# Altium project FT2232_JTAG.PrjPcb
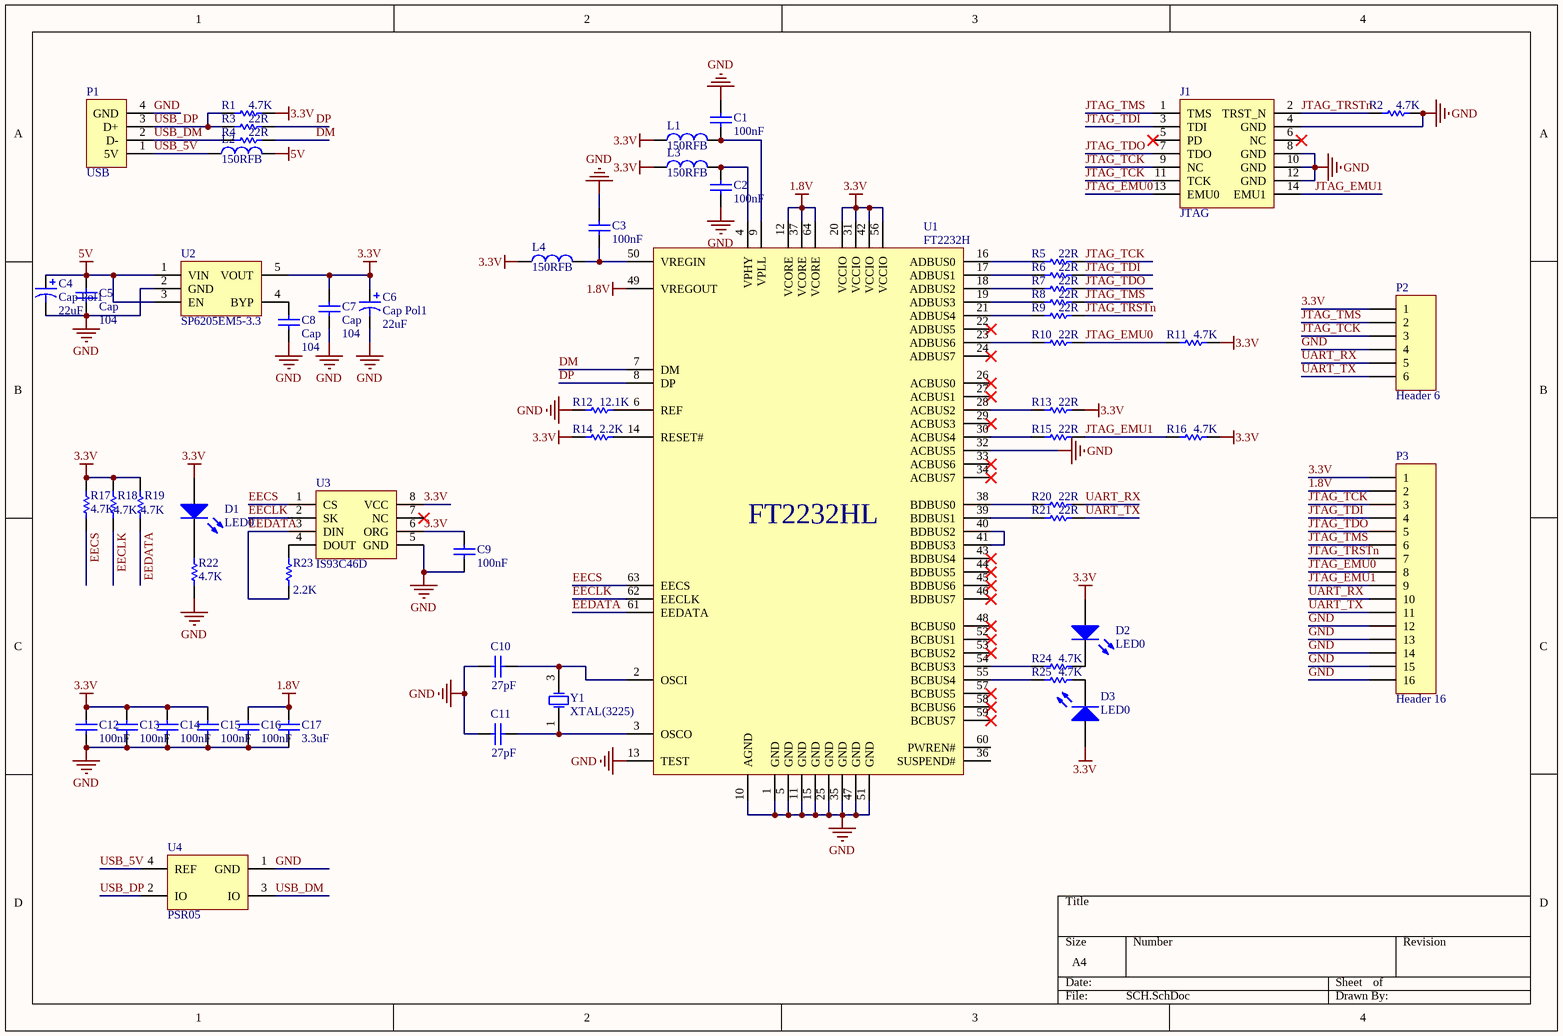
[diagram p0: SCH.SchDoc]
1 sheet, 58 parts. Net scope: global (net labels, ports and power ports of the same name join across sheets).
Board file: PCB.PcbDoc

## Sheet SCH.SchDoc
size A4

### Parts
C1  value 100nF  [C0603]  (hidden comment: Cap)
C2  value 100nF  [C0603]  (hidden comment: Cap)
C3  value 100nF  [C0603]  (hidden comment: Cap)
C4  Cap Pol1  value 22uF  [C0805]
C5  Cap  value 104  [C0603]
C6  Cap Pol1  value 22uF  [C0805]
C7  Cap  value 104  [C0603]
C8  Cap  value 104  [C0603]
C9  value 100nF  [C0603]  (hidden comment: Cap)
C10  value 27pF  [C0603]  (hidden comment: Cap)
C11  value 27pF  [C0603]  (hidden comment: Cap)
C12  value 100nF  [C0603]  (hidden comment: Cap)
C13  value 100nF  [C0603]  (hidden comment: Cap)
C14  value 100nF  [C0603]  (hidden comment: Cap)
C15  value 100nF  [C0603]  (hidden comment: Cap)
C16  value 100nF  [C0603]  (hidden comment: Cap)
C17  value 3.3uF  [C0603]  (hidden comment: Cap)
D1  LED0  [0603D]
D2  LED0  [0603D]
D3  LED0  [0603D]
J1  JTAG  [HDR2X7]
L1  value 150RFB  [r0603]  (hidden comment: Inductors)
L2  value 150RFB  [r0603]  (hidden comment: Inductors)
L3  value 150RFB  [r0603]  (hidden comment: Inductors)
L4  value 150RFB  [r0603]  (hidden comment: Inductors)
P1  USB  [usb]
P2  Header 6  [1.0*6PIN/SMD H]
P3  Header 16  [0.5MMFPC_16P]
R1  value 4.7K  [R0603]  (hidden comment: Res1)
R2  value 4.7K  [R0603]  (hidden comment: Res1)
R3  value 22R  [R0603]  (hidden comment: Res1)
R4  value 22R  [R0603]  (hidden comment: Res1)
R5  value 22R  [R0603]  (hidden comment: Res1)
R6  value 22R  [R0603]  (hidden comment: Res1)
R7  value 22R  [R0603]  (hidden comment: Res1)
R8  value 22R  [R0603]  (hidden comment: Res1)
R9  value 22R  [R0603]  (hidden comment: Res1)
R10  value 22R  [R0603]  (hidden comment: Res1)
R11  value 4.7K  [R0603]  (hidden comment: Res1)
R12  value 12.1K  [R0603]  (hidden comment: Res1)
R13  value 22R  [R0603]  (hidden comment: Res1)
R14  value 2.2K  [R0603]  (hidden comment: Res1)
R15  value 22R  [R0603]  (hidden comment: Res1)
R16  value 4.7K  [R0603]  (hidden comment: Res1)
R17  value 4.7K  [R0603]  (hidden comment: Res1)
R18  value 4.7K  [R0603]  (hidden comment: Res1)
R19  value 4.7K  [R0603]  (hidden comment: Res1)
R20  value 22R  [R0603]  (hidden comment: Res1)
R21  value 22R  [R0603]  (hidden comment: Res1)
R22  value 4.7K  [R0603]  (hidden comment: Res1)
R23  value 2.2K  [R0603]  (hidden comment: Res1)
R24  value 4.7K  [R0603]  (hidden comment: Res1)
R25  value 4.7K  [R0603]  (hidden comment: Res1)
U1  FT2232H  [LQFP64]
U2  SP6205EM5-3.3  [SOT-23-5]
U3  IS93C46D  [SO8]
U4  PSR05  [SOT143]
Y1  XTAL(3225)  [Y3225]

### Nets
1.8V: C16.1 C17.1 P3.2 U1.12(VCORE) U1.37(VCORE) U1.49(VREGOUT) U1.64(VCORE)
3.3V: C6.1 C7.2 C9.1 C12.1 C13.1 C14.1 C15.1 D1.1(A) D2.1(A) D3.1(A) L1.1 L3.1 L4.1 P2.1 P3.1 R1.1 R11.1 R13.1 R14.2 R16.1 R17.1 R18.2 R19.2 U1.20(VCCIO) U1.31(VCCIO) U1.42(VCCIO) U1.56(VCCIO) U2.5(VOUT) U3.6(ORG) U3.8(VCC)
5V: C4.1 C5.2 L2.2 U2.1(VIN) U2.3(EN)
GND: C1.1 C2.2 C3.1 C4.2 C5.1 C6.2 C7.1 C8.1 C9.2 C10.2 C11.2 C12.2 C13.2 C14.2 C15.2 C16.2 C17.2 J1.4(GND) J1.8(GND) J1.10(GND) J1.12(GND) P1.4(GND) P2.4 P3.12 P3.13 P3.14 P3.15 P3.16 R2.1 R12.2 R22.2 U1.1(GND) U1.5(GND) U1.10(AGND) U1.11(GND) U1.13(TEST) U1.15(GND) U1.25(GND) U1.32(ACBUS5) U1.35(GND) U1.47(GND) U1.51(GND) U2.2(GND) U3.5(GND) U4.1(GND)
DM: R4.1 U1.7(DM)
DP: R3.1 U1.8(DP)
EECLK: R18.1 U1.62(EECLK) U3.2(SK)
EECS: R17.2 U1.63(EECS) U3.1(CS)
EEDATA: R19.1 R23.1 U1.61(EEDATA) U3.3(DIN)
JTAG_EMU0: J1.13(EMU0) P3.8 R10.1 R11.2
JTAG_EMU1: J1.14(EMU1) P3.9 R15.1 R16.2
JTAG_TCK: J1.9(NC) J1.11(TCK) P2.3 P3.3 R5.1
JTAG_TDI: J1.3(TDI) P3.4 R6.1
JTAG_TDO: J1.7(TDO) P3.5 R7.1
JTAG_TMS: J1.1(TMS) P2.2 P3.6 R8.1
JTAG_TRSTn: J1.2(TRST_N) P3.7 R2.2 R9.1
UART_RX: P2.5 P3.10 R20.1
UART_TX: P2.6 P3.11 R21.1
USB_5V: L2.1 P1.1(5V) U4.4(REF)
USB_DM: P1.2(D-) R4.2 U4.3(IO)
USB_DP: P1.3(D+) R1.2 R3.2 U4.2(IO)
NetC1_2: C1.2 L1.2 U1.9(VPLL)
NetC2_1: C2.1 L3.2 U1.4(VPHY)
NetC3_2: C3.2 L4.2 U1.50(VREGIN)
NetC8_2: C8.2 U2.4(BYP)
NetC10_1: C10.1 U1.2(OSCI) Y1.3(OSC2)
NetC11_1: C11.1 U1.3(OSCO) Y1.1(OSC1)
NetD1_2: D1.2(K) R22.1
NetD2_2: D2.2(K) R24.1
NetD3_2: D3.2(K) R25.1
NetR5_2: R5.2 U1.16(ADBUS0)
NetR6_2: R6.2 U1.17(ADBUS1)
NetR7_2: R7.2 U1.18(ADBUS2)
NetR8_2: R8.2 U1.19(ADBUS3)
NetR9_2: R9.2 U1.21(ADBUS4)
NetR10_2: R10.2 U1.23(ADBUS6)
NetR12_1: R12.1 U1.6(REF)
NetR13_2: R13.2 U1.28(ACBUS2)
NetR14_1: R14.1 U1.14(RESET#)
NetR15_2: R15.2 U1.30(ACBUS4)
NetR20_2: R20.2 U1.38(BDBUS0)
NetR21_2: R21.2 U1.39(BDBUS1)
NetR23_2: R23.2 U3.4(DOUT)
NetR24_2: R24.2 U1.54(BCBUS3)
NetR25_2: R25.2 U1.55(BCBUS4)
NetU1_40: U1.40(BDBUS2) U1.41(BDBUS3)

Not connected (* = marked no-connect by the designer): J1 5(PD)* 6(NC)*; U1 22(ADBUS5)* 24(ADBUS7)* 26(ACBUS0)* 27(ACBUS1)* 29(ACBUS3)* 33(ACBUS6)* 34(ACBUS7)* 36(SUSPEND#) 43(BDBUS4)* 44(BDBUS5)* 45(BDBUS6)* 46(BDBUS7)* 48(BCBUS0)* 52(BCBUS1)* 53(BCBUS2)* 57(BCBUS5)* 58(BCBUS6)* 59(BCBUS7)* 60(PWREN#); U3 7(NC)*

### Notes on the sheet
- (in symbol FT2232H) FT2232HL

### Library data of the parts
C1-C3 C5 C7-C17 = Cap: Capacitor; Published: 8-Jun-2000; LatestRevisionDate: 17-Jul-2002; LatestRevisionNote: Re-released for DXP Platform.; PackageReference: RAD-0.3; Publisher: Altium Limited
C4 C6 = Cap Pol1: Polarized Capacitor (Radial); Published: 8-Jun-2000; LatestRevisionDate: 17-Jul-2002; LatestRevisionNote: Re-released for DXP Platform.; PackageReference: RB7.6-15; Publisher: Altium Limited
D1-D3 = LED0: Typical INFRARED GaAs LED; Published: 8-Jun-2000; LatestRevisionDate: 08-Jul-2005; LatestRevisionNote: Mech Layer 1 removed.; PackageReference: LED-0; Publisher: Altium Limited
P2 = Header 6: Header, 6-Pin; LatestRevisionDate: 17-Jul-2002; LatestRevisionNote: Re-released for DXP Platform.; Publisher: Altium Limited
P3 = Header 16: Header, 16-Pin; LatestRevisionDate: 17-Jul-2002; LatestRevisionNote: Re-released for DXP Platform.; Publisher: Altium Limited
R1-R25 = Res1: Resistor; Published: 8-Jun-2000; LatestRevisionDate: 17-Jul-2002; LatestRevisionNote: Re-released for DXP Platform.; PackageReference: AXIAL-0.3; Publisher: Altium Limited
U2 = SP6205: AD3330
Y1 = XTAL(3225): Crystal Oscillator; Published: 8-Jun-2000; LatestRevisionDate: 17-Jul-2002; LatestRevisionNote: Re-released for DXP Platform.; PackageReference: R38; Publisher: Altium Limited